# Altium schematic sheet Sheet2.SchDoc
size A4; SheetNumber: 1; SheetTotal: 1
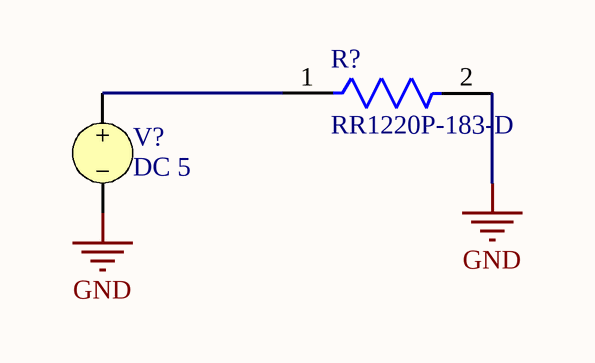
[diagram p0: Sheet2.SchDoc]

## Parts
R?  RR1220P-183-D  [FP-RR1220-IPC_A]
V?  DC 5

## Nets
GND: R?.2 V?.2
NetR?_1: R?.1 V?.1

## Library data of the parts
R? = CMP-2001-03295-2: 18kΩ ±0.5% 0.1W 1/10W Chip Resistor 0805 (2012 Metric) Thin Film; Voltage Rating: 100V; Temperature Coefficient: 25ppm/°C; Power Rating: 100mW; Resistance: 18kR; Length: 2mm; Lead Free: Lead Free; Height: 0.4mm; Depth: 1.25mm; Packaging: Tape and Reel; Min Operating Temperature: -55°C; Case Code (Metric): 2012; Termination: SMD/SMT; Voltage Rating (DC): 100V; Case/Package: 0805; Max Operating Temperature: 125°C; RoHS Compliant: Yes; Mount: Surface Mount; Case Code (Imperial): 0805; Technology: THIN FILM; Tolerance: 0.5%; Number of Terminations: 2; Max Power Dissipation: 100mW; Series: RR; Size Code: 0805
V? = VSRC: Voltage Source; Note: PCB Footprint - Not required; AC Magnitude: 1; AC Phase: 0; Value: 5; Published: 8-Jun-2000; LatestRevisionDate: 17-Jul-2002; LatestRevisionNote: Re-released for DXP Platform.; PackageReference: Not Applicable; Publisher: Altium Limited